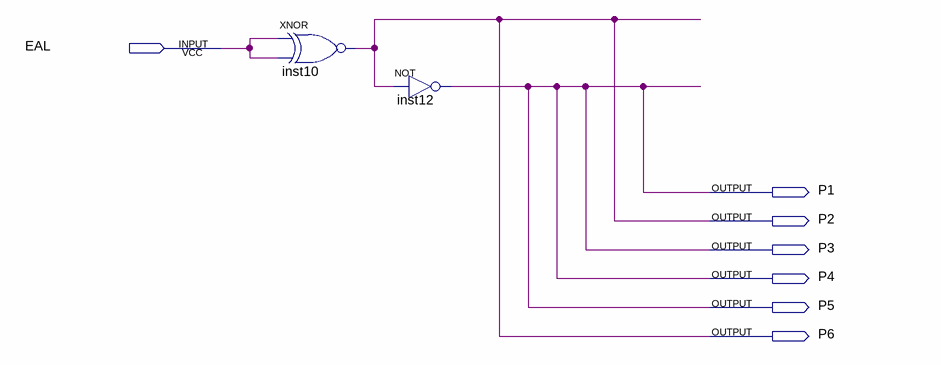
[diagram p0: schematic sheet]
// Quartus schematic Posicionador.bdf as structural Verilog: 2 symbols, 7 pins
module Posicionador (
  input  EAL,
  output P1,
  output P2,
  output P3,
  output P4,
  output P5,
  output P6
);

  xnor inst10 (P2, EAL, EAL);
  not inst12 (P1, P2);

  assign P3 = P1;
  assign P4 = P1;
  assign P5 = P1;
  assign P6 = P2;
endmodule
